# Altium schematic sheet 天地通门禁20813.SchDoc
size A2
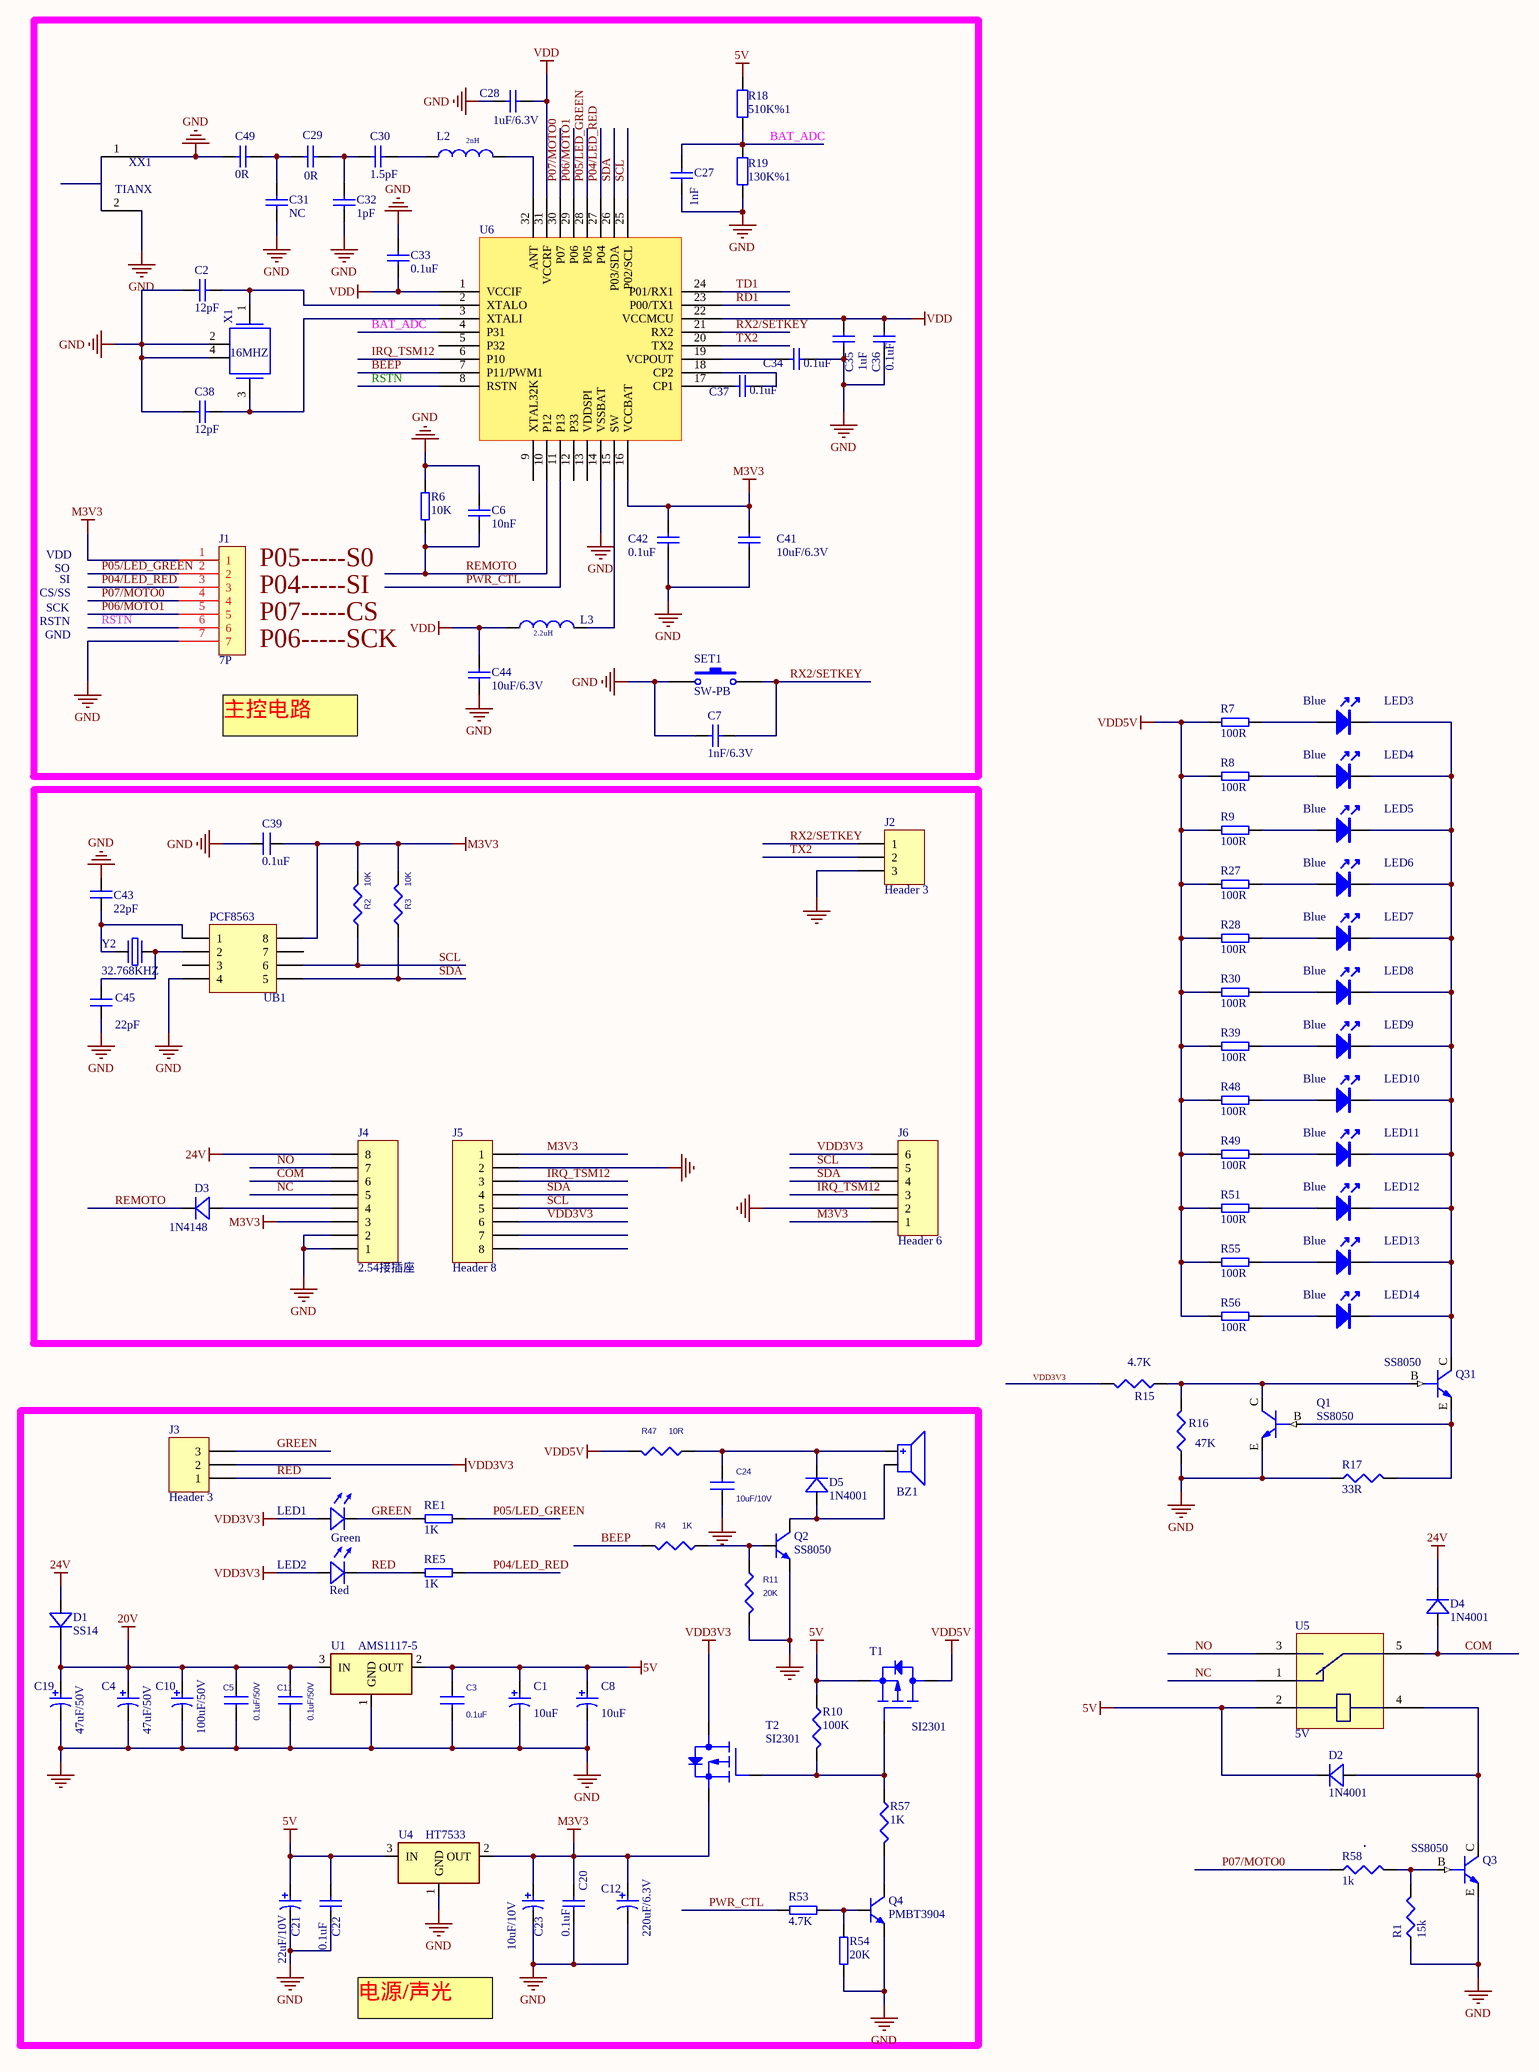
[diagram p0: 天地通门禁20813.SchDoc]

## Parts
BZ1  BUZZER  [BUZZ_EN]  (value not drawn)
C1  10uF  [R6.3*5.8]
C2  12pF  [0603C]
C3  0.1uF  [0603C]
C4  47uF/50V  [R6.3*7.7]
C5  0.1uF/50V  [0805C]
C6  10nF  [0603C]
C7  1nF/6.3V  [0603C]
C8  10uF  [0805C]
C10  100uF/50V  [R6.3*7.7]
C11  0.1uF/50V  [0805C]
C12  220uF/6.3V  [R6.3*5.8]
C19  47uF/50V  [R6.3*7.7]
C20  0.1uF  [0603C]
C21  22uF/10V  [0805C]
C22  0.1uF  [0603C]
C23  10uF/10V  [0805C]
C24  10uF/10V  [0805C]
C27  1nF  [0603C]
C28  1uF/6.3V  [0603C]
C29  0R  [0603C]
C30  1.5pF  [0603C]
C31  NC  [0603C]
C32  1pF  [0603C]
C33  0.1uF  [0603C]
C34  0.1uF  [0603C]
C35  1uF  [0603C]
C36  0.1uF  [0603C]
C37  0.1uF  [0603C]
C38  12pF  [0603C]
C39  0.1uF  [0603C]
C41  10uF/6.3V  [0603C]
C42  0.1uF  [0603C]
C43  22pF  [0603C]
C44  10uF/6.3V  [0603C]
C45  22pF  [0603C]
C49  0R  [0603C]
D1  SS14  [DO-214AA]
D2  1N4001  [M7]
D3  1N4148  [SOD-123]
D4  1N4001  [M7]
D5  1N4001  [M7]
J1  7P  [7P-2.0MM]
J2  Header 3  [3P-2.0MM]
J3  Header 3  [3PIN-2.0]
J4  2.54接插座  [2.54螺丝接线座8P]
J5  Header 8  [8P-1.25mm]
J6  Header 6  [6P-1.25mm]
L2  2nH  [0603L]
L3  2.2uH  [0603L]
LED1  Green  [0805LED]
LED2  Red  [0805LED]
LED3  Blue  [0805LED]
LED4  Blue  [0805LED]
LED5  Blue  [0805LED]
LED6  Blue  [0805LED]
LED7  Blue  [0805LED]
LED8  Blue  [0805LED]
LED9  Blue  [0805LED]
LED10  Blue  [0805LED]
LED11  Blue  [0805LED]
LED12  Blue  [0805LED]
LED13  Blue  [0805LED]
LED14  Blue  [0805LED]
Q1  SS8050  [SOT-23 - BCE]
Q2  SS8050  [SOT-23-3L]
Q3  SS8050  [SOT-23 - BCE]
Q4  PMBT3904  [SOT-23-3L]
Q31  SS8050  [SOT-23 - BCE]
R1  15k  [0603R]
R2  10K  [0603R]
R3  10K  [0603R]
R4  1K  [0603R]
R6  10K  [0603R]
R7  100R  [0603R]
R8  100R  [0603R]
R9  100R  [0603R]
R10  100K  [0603R]
R11  20K  [0603R]
R15  4.7K  [0603R]
R16  47K  [0603R]
R17  33R  [0603R]
R18  510K%1  [0603R]
R19  130K%1  [0603R]
R27  100R  [0603R]
R28  100R  [0603R]
R30  100R  [0603R]
R39  100R  [0603R]
R47  10R  [0603R]
R48  100R  [0603R]
R49  100R  [0603R]
R51  100R  [0603R]
R53  4.7K  [0603R]
R54  20K  [0603R]
R55  100R  [0603R]
R56  100R  [0603R]
R57  1K  [0603R]
R58  1k  [0603R]
RE1  1K  [0603R]
RE5  1K  [0603R]
SET1  SW-PB  [KEY-S]
T1  SI2301  [SOT-23 - GDS]
T2  SI2301  [SOT-23 - GDS]
U1  AMS1117-5  [SOT223_M]
U4  HT7533  [SOT-23-3L]
U5  5V  [继电器1x]
U6  BK3431Q  [QFN32_4*4*0.4]  (value not drawn)
UB1  PCF8563  [SOP8]
X1  16MHZ  [XTAL3225]
XX1  TIANX  [BT_NAMI_1]
Y2  32.768KHZ  [晶振-9]

## Nets
5V: C1.1 C3.1 C8.1 C21.1 C22.1 D2.K(A) R10.1 R18.1 T1.S(SOURCE) U1.2(OUT) U4.3(IN) U5.2
20V: C4.1 C5.1 C10.1 C11.1 C19.1 D1.2(K) U1.3(IN)
24V: D1.1(A) D4.K(A) J4.8
GND: C1.2 C2.1 C3.2 C4.2 C5.2 C6.1 C7.2 C8.2 C10.2 C11.2 C12.2 C19.2 C20.2 C21.2 C22.2 C23.2 C24.1 C27.1 C28.1 C31.2 C32.1 C33.1 C34.2 C35.1 C36.1 C38.1 C39.2 C41.2 C42.2 C43.2 C44.1 C45.1 C49.1 J1.7 J2.3 J4.1 J4.2 J5.2 J6.2 Q1.E(EMITTER) Q2.2 Q3.E(EMITTER) Q4.2 R1.1 R6.2 R11.2 R16.1 R17.1 R19.2 R54.1 SET1.1 U1.1(GND) U4.1(GND) U6.14(VSSBAT) UB1.4 X1.2 X1.4 XX1.1 XX1.2
M3V3: C12.1 C20.1 C23.1 C39.1 C41.1 C42.1 J1.1 J4.3 J5.1 J6.1 R2.1 R3.1 T2.S(SOURCE) U4.2(OUT) U6.16(VCCBAT) UB1.8
VDD: C28.2 C33.2 C35.2 C36.2 C44.2 L3.1(P1) U6.1(VCCIF) U6.22(VCCMCU) U6.31(VCCRF)
VDD3V3: J3.2 J5.6 J6.6 LED1.1(A) LED2.1(A) R15.2 T2.D(DRAIN)
VDD5V: R7.1 R8.1 R9.1 R27.1 R28.1 R30.1 R39.1 R47.2 R48.1 R49.1 R51.1 R55.1 R56.1 T1.D(DRAIN)
BAT_ADC: C27.2 R18.2 R19.1 U6.4(P31)
BEEP: R4.2 U6.7(P11/PWM1)
COM: D4.A(K) J4.6 U5.5
GREEN: J3.3 LED1.2(K) RE1.1
IRQ_TSM12: J5.3 J6.3 U6.6(P10)
NC: J4.5 U5.1
NO: J4.7 U5.3
P04/LED_RED: J1.3 RE5.2 U6.27(P04)
P05/LED_GREEN: J1.2 RE1.2 U6.28(P05)
P06/MOTO1: J1.5 U6.29(P06)
P07/MOTO0: J1.4 R58.1 U6.30(P07)
PWR_CTL: R53.1 U6.11(P13)
RD1: U6.23(P00/TX1)
RED: J3.1 LED2.2(K) RE5.1
REMOTO: C6.2 D3.2(K) R6.1 U6.10(P12)
RSTN: J1.6 U6.8(RSTN)
RX2/SETKEY: C7.1 J2.1 SET1.2 U6.21(RX2)
SCL: J5.5 J6.5 R2.2 U6.25(P02/SCL) UB1.6
SDA: J5.4 J6.4 R3.2 U6.26(P03/SDA) UB1.5
TD1: U6.24(P01/RX1)
TX2: J2.2 U6.20(TX2)
NetBZ1_1: BZ1.1 C24.2 D5.K(A) R47.1
NetBZ1_2: BZ1.2 D5.A(K) Q2.3
NetC2_2: C2.2 U6.2(XTALO) X1.1
NetC29_1: C29.1 C31.1 C49.2
NetC29_2: C29.2 C30.2 C32.2
NetC30_1: C30.1 L2.1(P1)
NetC34_1: C34.1 U6.19(VCPOUT)
NetC37_1: C37.1 U6.17(CP1)
NetC37_2: C37.2 U6.18(CP2)
NetC38_2: C38.2 U6.3(XTALI) X1.3
NetC43_1: C43.1 UB1.1 Y2.2
NetC45_2: C45.2 UB1.2 Y2.1
NetD2_A: D2.A(K) Q3.C(COLLECTOR) U5.4
NetD3_1: D3.1(A) J4.4
NetL2_2: L2.2(P2) U6.32(ANT)
NetL3_2: L3.2(P2) U6.15(SW)
NetLED3_1: LED3.1 R7.2
NetLED3_2: LED3.2 LED4.2 LED5.2 LED6.2 LED7.2 LED8.2 LED9.2 LED10.2 LED11.2 LED12.2 LED13.2 LED14.2 Q31.C(COLLECTOR)
NetLED4_1: LED4.1 R8.2
NetLED5_1: LED5.1 R9.2
NetLED6_1: LED6.1 R27.2
NetLED7_1: LED7.1 R28.2
NetLED8_1: LED8.1 R30.2
NetLED9_1: LED9.1 R39.2
NetLED10_1: LED10.1 R48.2
NetLED11_1: LED11.1 R49.2
NetLED12_1: LED12.1 R51.2
NetLED13_1: LED13.1 R55.2
NetLED14_1: LED14.1 R56.2
NetQ1_B: Q1.B(BASE) Q31.E(EMITTER) R17.2
NetQ1_C: Q1.C(COLLECTOR) Q31.B(BASE) R15.1 R16.2
NetQ2_1: Q2.1 R4.1 R11.1
NetQ3_B: Q3.B(BASE) R1.2 R58.2
NetQ4_1: Q4.1 R53.2 R54.2
NetQ4_3: Q4.3 R57.2
NetR10_2: R10.2 R57.1 T1.G(GATE) T2.G(GATE)

Not connected (* = marked no-connect by the designer): J5 7 8; U6 5(P32) 9(XTAL32K) 12(P33) 13(VDDSPI); UB1 3 7

## Notes on the sheet
- VDD
- RSTN
- CS/SS
- SCK
- SO
- SI
- P04-----SI
- P05-----S0
- (near J1) P07-----CS
- GND
- (near J1) P06-----SCK
- 主控电路
- 电源/声光

## Library data of the parts
C1 C4 C8 C10 C12 C19 C21 C23 = CAP-P: Capacitor, tolerance ±20%
C2 C6 C7 C28-C38 C41 C42 C44 C49 = Cap: Capacitor; Value: 10pF; Published: 8-Jun-2000; LatestRevisionDate: 17-Jul-2002; LatestRevisionNote: Re-released for DXP Platform.; PackageReference: RAD-0.3; Publisher: Altium Limited; PackageDescription: Radial Cap, Thru-Hole; 2 Leads; 0.3 in Pin Spacing
C3 C5 C11 = CAP NP
C20 C22 C27 = CAP-NP: Capacitor, Ceramic; Capacitance: 18 pF; Dielectric: COG; Polarity: Non-Polarized; Rated Voltage: 50 mV; Tolerance: 5 %; Category: Capacitor; Mounting Technology: Surface Mount; Status: Unreleased; Technology: Ceramic
C24 = C_0_Dup1
C39 C43 C45 = C
D1-D5 = D
J2 J3 = Header 3: Header, 3-Pin; LatestRevisionDate: 17-Jul-2002; LatestRevisionNote: Re-released for DXP Platform.; Publisher: Altium Limited
J4 J5 = Header 8: Header, 8-Pin; LatestRevisionDate: 17-Jul-2002; LatestRevisionNote: Re-released for DXP Platform.; Publisher: Altium Limited
J6 = Header 6: Header, 6-Pin; LatestRevisionDate: 17-Jul-2002; LatestRevisionNote: Re-released for DXP Platform.; Publisher: Altium Limited
L2 L3 = INDUCTOR: Power Inductor, 4.7uH, 0.7A, 260mR DCR; XMOS Part Number: E-09-0011; Manufacturer: Taiyo Yuden; Manufacturer Part Number: CBC2518T4R7M; Part Creator: JG; LEVEL: STD; DEVICE: L; FORWARD_PCB: 1; Tolerance (%): 20; Max DC Resistance: 0.26R; Rated Current (Saturation): 0.68A; Rated Current (Temp Rise): 0.92A; Approx Volume Cost ($): 0.07; Approved: NO; VALUE: 2.0nH; Datasheet: http://www.yuden.co.jp/us/product/pdf/ecb2_e.pdf; Max Height (mm): 2; Digikey Link: http://search.digikey.com/scripts/DkSearch/dksus.dll?lang=en&site=US&keywords=CBC2518T4R7M
LED1-LED14 = LED
Q1 Q3 Q31 = PMBT3904
Q2 Q4 = NPN_BJT: Bipolar Junction Transistor
R1 R6-R10 R15-R17 R27 R28 R30 R39 R48 R49 R51 R53-R58 RE1 RE5 = R
R2 R3 = RES
R4 R11 R47 = R_Dup1
R18 R19 = Res2: Resistor; Value: 470K; Published: 2013年12月24日; LatestRevisionDate: 2013年12月24日; LatestRevisionNote: Re-released for DXP Platform.
SET1 = SW-PB: Switch; Published: 24-Mar-1999; LatestRevisionDate: 17-Jul-2002; LatestRevisionNote: Re-released for DXP Platform.; PackageReference: SPST-2; Publisher: Altium Limited
T1 T2 = PWRMOSFET_EP_DGS_0
U1 U4 = XC6206P302M
U5 = OMRON_G8P-1A4P
UB1 = IC8
X1 = OSC: XMOS Part Number: E-07-0030; Manufacturer: Abracon; Manufacturer Part Number: ABLS-24.000MHz-B4; Part Creator: JG; LEVEL: STD; DEVICE: X; FORWARD_PCB: 1; Approx Volume Cost ($): 0.15; Approved: NO; VALUE: ABLS; FREQUENCY: 38.4MHZ; Datasheet: http://www.abracon.com/Resonators/abls.pdf; Max Height (mm): 4.2; Supplier Link: http://search.digikey.com/scripts/DkSearch/dksus.dll?lang=en&site=US&keywords=ABLS-24.000MHz-B4
Y2 = 晶振